# Altium project pqm_v2.PrjPCB (part 1 of 2)
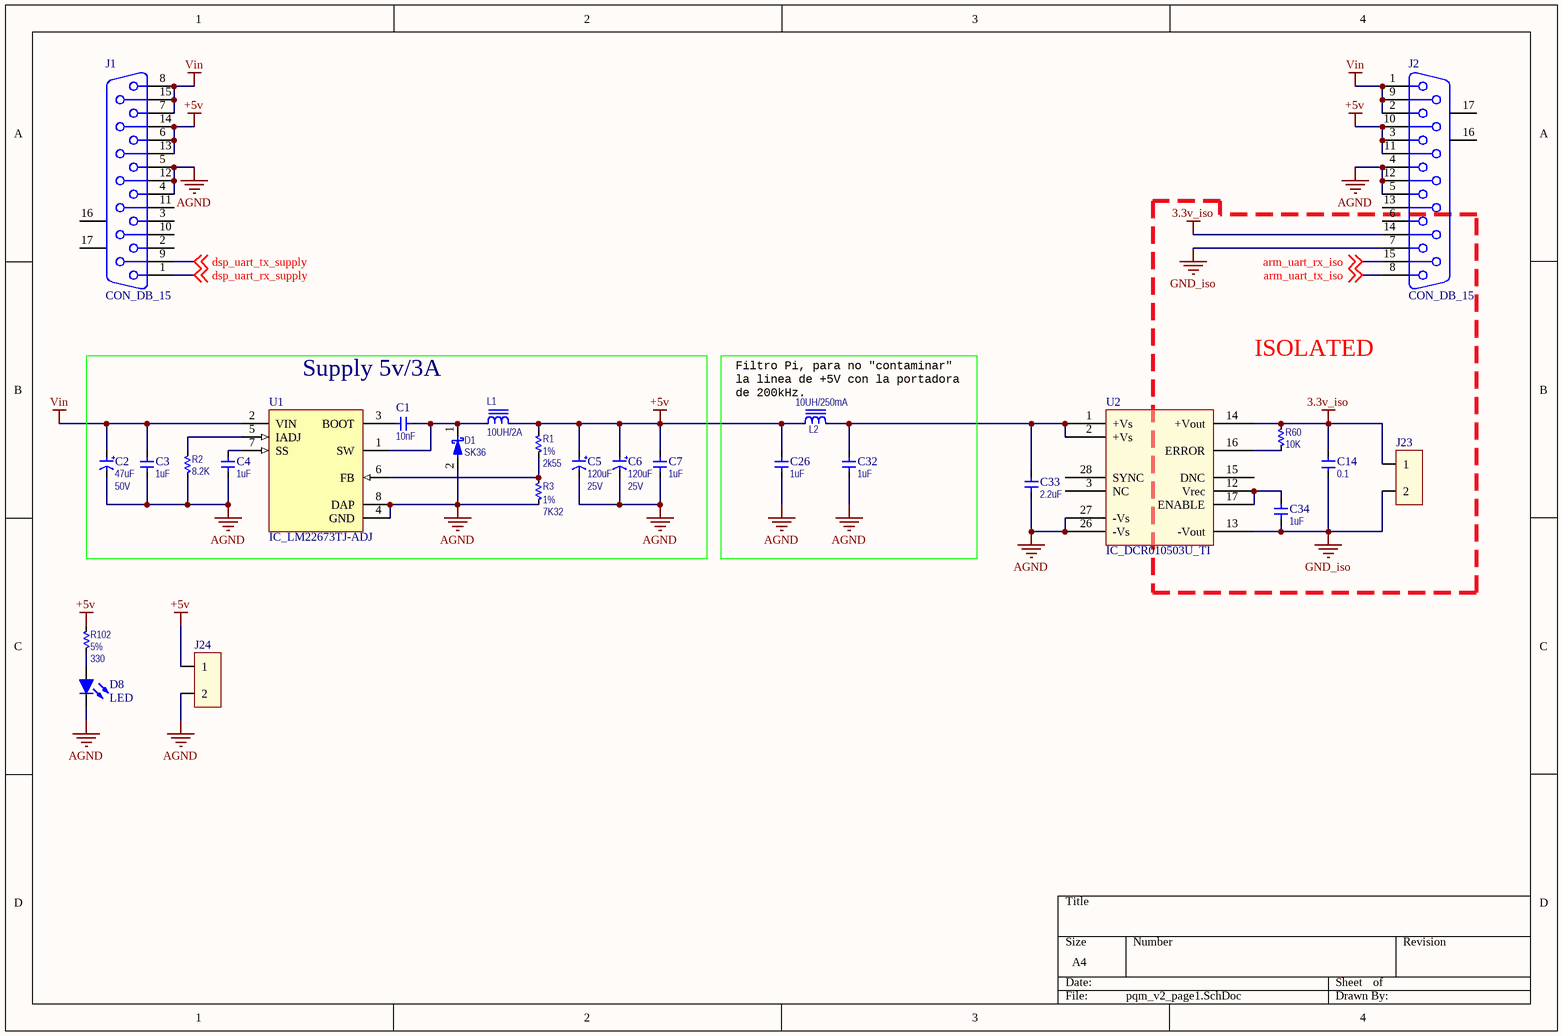
[diagram p0: pqm_v2_page1.SchDoc]
5 sheets, 276 parts. Net scope: global (net labels, ports and power ports of the same name join across sheets).
Board file: pqm_v2.PcbDoc
Sheets:
  pqm_v2_page1.SchDoc
  pqm_v2_page2.SchDoc
  pqm_v2_page3.SchDoc
  pqm_v2_page4.SchDoc
  pqm_v2_page5.SchDoc

## Sheet pqm_v2_page1.SchDoc: Power Quality Monitor
size A4

### Parts
C1  value 10nF  [CAPC3216X135N_B]  (hidden comment: CAP_C3216X7R2J103K115AA_TDK)
C2  value 47uF  Voltage Rating: 50V  [CAPAE630770X770N]  (hidden comment: CAP_EEE-1HA470XP_PANASONIC)
C3  value 1uF  [CAPC3216X135N_B]  (hidden comment: CAP_C3216X7R1E105M085AA_TDK)
C4  value 1uF  [CAPC3216X135N_B]  (hidden comment: CAP_C3216X7R1E105M085AA_TDK)
C5  value 120uF  Voltage Rating: 25V  [CAPPRD250W50D630H1250]  (hidden comment: CAP_ELXY250ELL121MF15D_UC)
C6  value 120uF  Voltage Rating: 25V  [CAPPRD250W50D630H1250]  (hidden comment: CAP_ELXY250ELL121MF15D_UC)
C7  value 1uF  [CAPC3216X135N_B]  (hidden comment: CAP_C3216X7R1E105M085AA_TDK)
C14  value 0.1  [CAPC2013X110N]  (hidden comment: CAP_CC0805KRX7R8BB104_YAGEO)
C26  value 1uF  [CAPC3216X135N_B]  (hidden comment: CAP_C3216X7R1E105M085AA_TDK)
C32  value 1uF  [CAPC3216X135N_B]  (hidden comment: CAP_C3216X7R1E105M085AA_TDK)
C33  value 2.2uF  [CAPC3216X135N_B]  (hidden comment: CAP_CC1206KKX7R7BB225_YAGEO)
C34  value 1uF  [CAPC2013X110N]  (hidden comment: CAP_CC0805KKX7R7BB105_YAGEO)
D1  value SK36  [DIOM7959X262N]  (hidden comment: DIO_SK36_MICROCOM)
D8  LED  [Led]
J1  CON_DB_15  [788757-1]
J2  CON_DB_15  [788757-1]
J23  CON_RADX2  [RAD2]  (value not drawn)
J24  CON_RADX2  [RAD2]  (value not drawn)
L1  value 10UH/2A  [MAG_INDUCTOR2A]  (hidden comment: MAG_SRR1005-100M_BOURNS)
L2  value 10UH/250mA  [INDC4532X170N]  (hidden comment: MAG_CM453232-100KLCT_BOURNS)
R1  value 2k55  Tolerance: 1%  [RESC3216N]  (hidden comment: RES_ERJ-8ENF2551V_Panasonic)
R2  value 8.2K  [RESC3216N]  (hidden comment: RES_ERJ-8GEYJ822V_Panasonic)
R3  value 7K32  Tolerance: 1%  [RESC3216N]  (hidden comment: RES_ERJ-8ENF7321V_Panasonic)
R60  value 10K  [RESC3216N]  (hidden comment: RES_RC1206FR-0710KL_Yageo)
R102  value 330  Tolerance: 5%  [RESC2013X065BN]  (hidden comment: RES_RC0805JR-07330RL_YAGEO)
U1  IC_LM22673TJ-ADJ  [TJ7A_N]
U2  IC_DCR010503U_TI  [SOP28]

### Blocks framed on the sheet
ISOLATED: C14 C34 J23 R60 U2
Supply 5v/3A: C1-C7 D1 L1 R1-R3 U1

### Nets
3.3v_iso: C14.1(T1) J2.14 J23.1 R60.2(T2) U2.14(+Vout)
+5v: C5.1 C6.1 C7.1(T1) C26.1(T1) J1.6 J1.13 J1.14 J2.3 J2.10 J2.11 J24.1 L1.2 L2.1 R1.1(T1) R102.2(T2)
AGND: C2.2 C3.2(T2) C4.2(T2) C5.2 C6.2 C7.2(T2) C26.2(T2) C32.2(T2) C33.2(T2) D1.2(A) D8.2(K) J1.4 J1.5 J1.12 J2.4 J2.5 J2.12 J24.2 R2.1(T1) R3.2(T2) U1.4(GND) U1.8(DAP) U2.26(-Vs) U2.27(-Vs)
GND_iso: C14.2(T2) C34.2(T2) J2.7 J23.2 U2.13(-Vout)
Vin: C2.1 C3.1(T1) J1.7 J1.8 J1.15 J2.1 J2.2 J2.9 U1.2(VIN)
arm_uart_rx_iso: J2.15 ; off-sheet arm_uart_rx_iso
arm_uart_tx_iso: J2.8 ; off-sheet arm_uart_tx_iso
dsp_uart_rx_supply: J1.1 ; off-sheet dsp_uart_rx_supply
dsp_uart_tx_supply: J1.9 ; off-sheet dsp_uart_tx_supply
NetC1_1: C1.1(T1) U1.3(BOOT)
NetC1_2: C1.2(T2) D1.1(K) L1.1 U1.1(SW)
NetC4_1: C4.1(T1) U1.7(SS)
NetC32_1: C32.1(T1) C33.1(T1) L2.2 U2.1(+Vs) U2.2(+Vs)
NetC34_1: C34.1(T1) U2.12(Vrec) U2.17(ENABLE)
NetD8_1: D8.1(A) R102.1(T1)
NetR1_2: R1.2(T2) R3.1(T1) U1.6(FB)
NetR2_2: R2.2(T2) U1.5(IADJ)
NetR60_1: R60.1(T1) U2.16(ERROR)

Not connected (* = marked no-connect by the designer): J1 2 3 10 11 16(MH1) 17(MH2); J2 6 13 16(MH1) 17(MH2); U2 3(NC) 15(DNC) 28(SYNC)

### Notes on the sheet
- (near L2) Filtro Pi, para no "contaminar" la linea de +5V con la portadora de 200kHz.

### Library data of the parts
C1 = CAP_C3216X7R2J103K115AA_TDK: 10000pF, 630 V, Capacitores cerámicos, X7R, 1206 (3216 métrico), 0.126" L x 0.063" A (3.20 mm x 1.60 mm); Manufacturer: TDK; Tolerance: 10%; Voltage Rating: 630 V; Supplier: *; Supplier Part No: *; Power Rating: *; BOM Populate: *; Digikey Part Number: 445-2291-1-ND; Mouser Part Number: 810-C3216X7R2J103K; Manufacturer Part Number: C3216X7R2J103K115AA
C2 = CAP_EEE-1HA470XP_PANASONIC: 47µF 50V Aluminum Capacitors Radial, Can - SMD 2000 Hrs @ 85°C; Tolerance: 20%; BOM Populate: *; Power Rating: *; Supplier Part No: *; Supplier: *; Manufacturer: Panasonic; Petra Part No: *; Digikey Part Number: PCE3929CT-ND; Mouser Part Number: 667-EEE-1HA470XP; Manufacturer Part Number: EEE-1HA470XP
C3 C4 C7 C26 C32 = CAP_C3216X7R1E105M085AA_TDK: 1 µF, 25 V, Capacitores cerámicos, X7R, 1206 (3216 métrico), 0.126" L x 0.063" A (3.20 mm x 1.60 mm); Manufacturer: TDK; Tolerance: 20%; Voltage Rating: 25V; Supplier: *; Supplier Part No: *; Power Rating: *; BOM Populate: *; Digikey Part Number: 445-4024-1-ND; Mouser Part Number: 810-C3216X7R1E105M-2; Manufacturer Part Number: C3216X7R1E105M085AA
C5 C6 = CAP_ELXY250ELL121MF15D_UC: CAP ALUM 120UF 20% 25V RADIAL; BOM Populate: *; Power Rating: *; Supplier Part No: *; Supplier: *; Digikey Part Number: 565-1791-ND; Tolerance: 20%; Petra Part No: *; Mouser Part Number: 661-ELXY250ELL121MF1; Manufacturer Part Number: ELXY250ELL121MF15D
C14 = CAP_CC0805KRX7R8BB104_YAGEO: CAP CER 0.1UF 25V 10% X7R 0805; Manufacturer: Yageo; Supplier: *; Tolerance: 10%; Power Rating: *; Voltage Rating: 25V; BOM Populate: *; Digikey Part Number: 311-1141-1-ND; Mouser Part Number: 603-CC805KRX7R8BB104; Manufacturer Part Number: CC0805KRX7R8BB104
C33 = CAP_CC1206KKX7R7BB225_YAGEO: CAP CER 2.2UF 16V X7R 1206; Manufacturer: YAGEO; Tolerance: 10%; Supplier: *; Supplier Part No: *; Power Rating: *; BOM Populate: *; Voltage Rating: 16V; Digikey Part Number: 311-1957-1-ND; Mouser Part Number: 603-CC126KKX7R7BB225; Manufacturer Part Number: CC1206KKX7R7BB225
C34 = CAP_CC0805KKX7R7BB105_YAGEO: CAP CER 1UF 16V X7R 0805; Manufacturer: YAGEO; Tolerance: 10%; Supplier: *; Supplier Part No: *; Power Rating: *; BOM Populate: *; Voltage Rating: 16V; Digikey Part Number: 311-1365-1-ND; Mouser Part Number: 603-CC805KKX7R7BB105; Manufacturer Part Number: CC0805KKX7R7BB105
D1 = DIO_SK36_MICROCOM: DIODE SCHOTTKY 60V 3A SMC; Manufacturer: Micro Commercial Co; Manufacturer Part Number: SK36-TP; BOM Populate: *; Voltage Rating: 60V; Supplier Part No: *; Supplier: *; Digikey Part Number: SK36-TPMSCT-ND; Tolerance: *; Power Rating: *; Mouser Part Number: 833-SK36-TP
D8 = LED0: Published: 8-Jun-2000; LatestRevisionDate: 08-Jul-2005; LatestRevisionNote: Mech Layer 1 removed.; PackageReference: LED-0; Publisher: Altium Limited
J1 J2 = 788781-1: Receptacle Assembly, 15 Position, Right Angle, 8.08mm Series, Amplimite, with Screwlocks; Positions: 15; MatingConnector: Female Screw Locks; PCB_Layout: Complies with manufacturer's recommendation.; DrillSize: Corresponds to nominal value.; Published: 15-Jun-2001; LatestRevisionDate: 17-Jul-2002; LatestRevisionNote: Re-released for DXP Platform.; DatasheetDocument: Sep-1999; PackageDocument: Sep-1999; PackageReference: 788781-1; Publisher: Altium Limited; Orientation: Right Angle; Gender: Receptacle; ShellSize: 2; ComponentLink1Description: Manufacturer Link; ComponentLink1URL: http://www.tycoelectronics.com/; ComponentLink2Description: Packaging Specification; ComponentLink2URL: http://ecommas.tycoelectronics.com/commerce/DocumentDelivery/DDEController?Action=showdoc&DocId=Customer+Drawing%7F788781%7FO%7Fpdf%7FEnglish%7FENG_CD_788781_O.pdf
L1 = MAG_SRR1005-100M_BOURNS: FIXED IND 10UH 2A 65 MOHM SMD; Manufacturer: Bourns Inc; BOM Populate: *; Current Rating: *; Supplier: *; Supplier Part No: *; Voltage Rating: *; Tolerance: *; Digikey Part Number: SRR1005-100MCT-ND; Manufacturer Part Number: SRR1005-100M; Mouser Part Number: 652-SRR1005-100M
L2 = MAG_CM453232-100KLCT_BOURNS: FIXED IND 10UH 2A 65 MOHM SMD; Manufacturer: Bourns Inc; BOM Populate: *; Current Rating: *; Supplier: *; Supplier Part No: *; Voltage Rating: *; Tolerance: *; Digikey Part Number: CM453232-100KLCT-ND; Manufacturer Part Number: CM453232-100KL; Mouser Part Number: 652-CM453232-100KL
R1 = RES_ERJ-8ENF2551V_Panasonic: RES SMD 2.55K OHM 1% 1/4W 1206; BOM Populate: *; Supplier Part No: *; Supplier: *; Manufacturer: Panasonic; Digikey Part Number: P2.55KFCT-ND; Power Rating: 1/4W; Manufacturer Part Number: ERJ-8ENF2551V; Mouser Part Number: 667-ERJ-8ENF2551V
R2 = RES_ERJ-8GEYJ822V_Panasonic: RES SMD 8.2K OHM 5% 1/4W 1206; BOM Populate: *; Supplier Part No: *; Supplier: *; Tolerance: 5%; Manufacturer: Panasonic; Digikey Part Number: P8.2KECT-ND; Power Rating: 1/4W; Manufacturer Part Number: ERJ-8GEYJ822V; Mouser Part Number: 667-ERJ-8GEYJ822V
R3 = RES_ERJ-8ENF7321V_Panasonic: RES SMD 7.32K OHM 1% 1/4W 1206; BOM Populate: *; Supplier Part No: *; Supplier: *; Manufacturer: Panasonic; Digikey Part Number: P7.32KFCT-ND; Power Rating: 1/4W; Manufacturer Part Number: ERJ-8ENF7321V; Mouser Part Number: 667-ERJ-8ENF7321V
R60 = RES_RC1206FR-0710KL_Yageo: RES SMD 10K OHM 1% 1/4W 1206; Manufacturer: Yageo; BOM Populate: *; Supplier Part No: *; Supplier: *; Tolerance: 1%; Digikey Part Number: 311-10.0KFRCT-ND; Power Rating: 1/4W; Manufacturer Part Number: RC1206FR-0710KL; Mouser Part Number: 603-RC1206FR-0710KL
R102 = RES_RC0805JR-07330RL_YAGEO: RES SMD 330 OHM 5% 1/8W 0805; Manufacturer: Yageo; BOM Populate: *; Supplier Part No: *; Supplier: *; Digikey Part Number: 311-330ARCT-ND; Power Rating: 1/8W; Manufacturer Part Number: RC0805JR-07330RL; Mouser Part Number: 603-RC0805JR-07330RL
U1 = IC_LM22673TJ-ADJ: 3A SIMPLE SWITCHER® Step-Down Voltage Regulator with Adjustable Soft-Start and Current Limit, 7-pin TO-263 Thin; Manufacturer Part Number: LM22673TJ-ADJ/NOPB; Digikey Part Number: LM22673TJ-ADJ/NOPBCT-ND; Mouser Part Number: 926-LM22673TJADJNOPB
U2 = IC_DCR010503U_TI: IC REG ISOLATED 3.3V 0.3A 12SOP; Digikey Part Number: 296-9450-5-ND; Mouser Part Number: 595-DCR010503U; Manufacturer Part Number: DCR010503U

## Sheet pqm_v2_page2.SchDoc
size A4
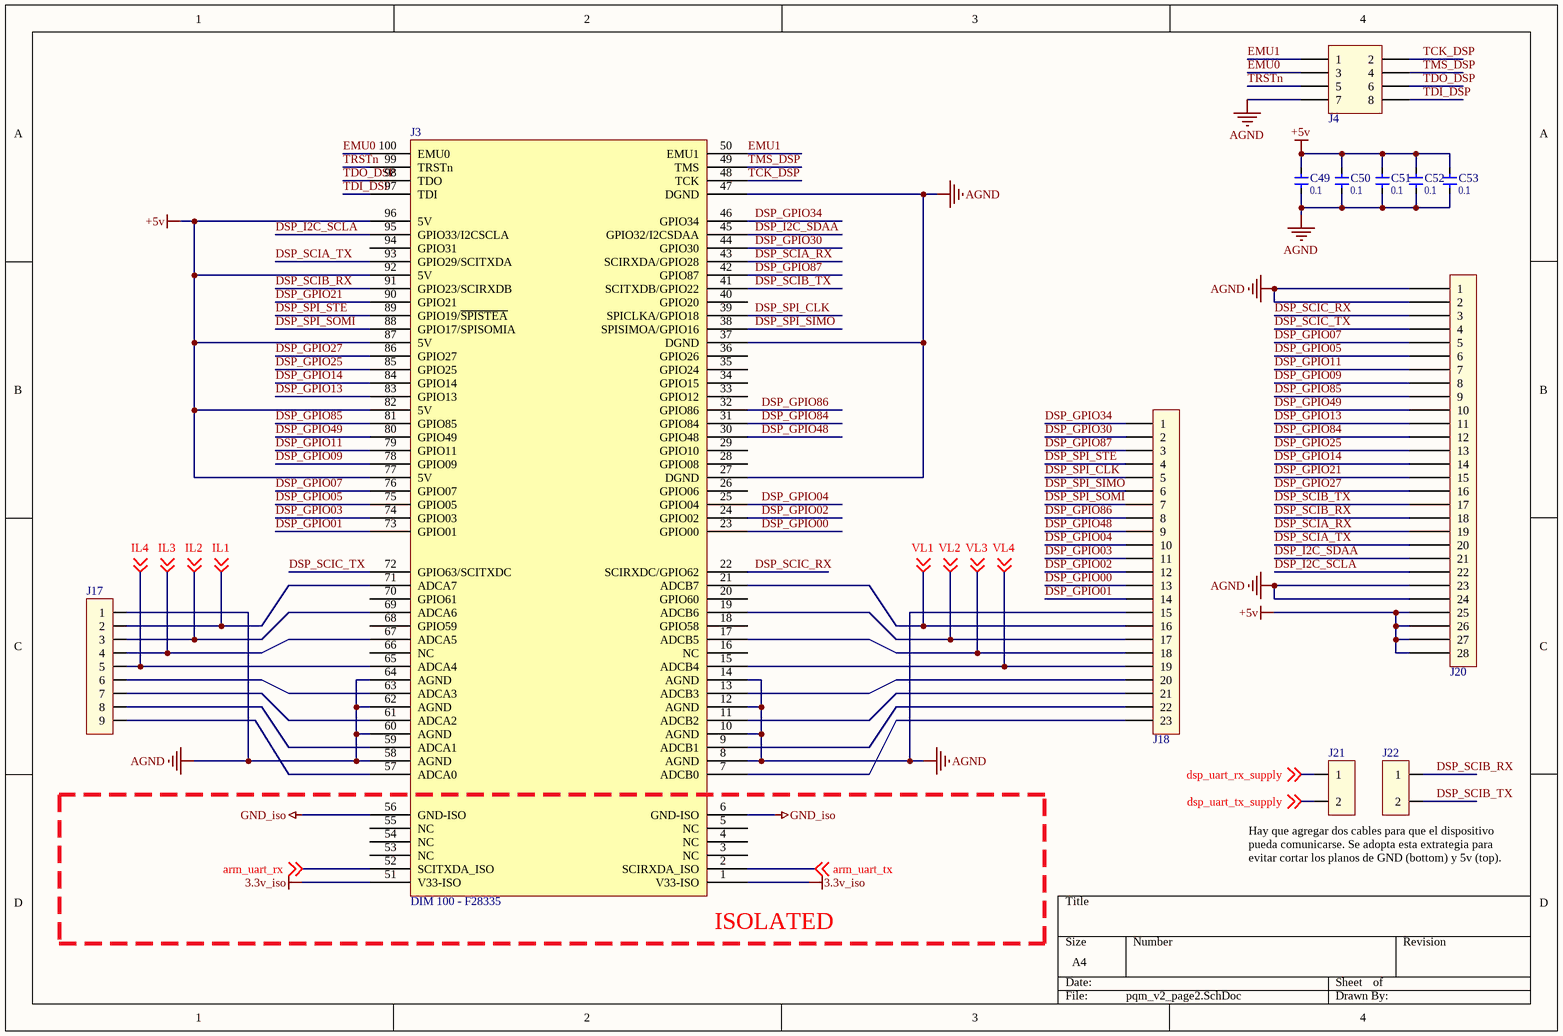
[diagram p1: pqm_v2_page2.SchDoc]

### Parts
C49  value 0.1  [CAPC2013X110N]  (hidden comment: CAP_CC0805KRX7R8BB104_YAGEO)
C50  value 0.1  [CAPC2013X110N]  (hidden comment: CAP_CC0805KRX7R8BB104_YAGEO)
C51  value 0.1  [CAPC2013X110N]  (hidden comment: CAP_CC0805KRX7R8BB104_YAGEO)
C52  value 0.1  [CAPC2013X110N]  (hidden comment: CAP_CC0805KRX7R8BB104_YAGEO)
C53  value 0.1  [CAPC2013X110N]  (hidden comment: CAP_CC0805KRX7R8BB104_YAGEO)
J3  DIM 100 - F28335  [DIMM1.27-2V100]
J4  CON_Header_2X4  [HDR2X4]  (value not drawn)
J17  COM_HeaderX9  [HDRX9]  (value not drawn)
J18  Header_DSP_1  [HEADER_DSP_1]  (value not drawn)
J20  CON_HeaderX30  [HeaderX30]  (value not drawn)
J21  CON_RADX2b  [RAD2b]  (value not drawn)
J22  CON_RADX2b  [RAD2b]  (value not drawn)

### Nets
3.3v_iso: J3.1(V33-ISO) J3.51(V33-ISO)
+5v: C49.1(T1) C50.1(T1) C51.1(T1) C52.1(T1) C53.1(T1) J3.77(5V) J3.82(5V) J3.87(5V) J3.92(5V) J3.96(5V) J20.25 J20.26 J20.27 J20.28
AGND: C49.2(T2) C50.2(T2) C51.2(T2) C52.2(T2) C53.2(T2) J3.8(AGND) J3.10(AGND) J3.12(AGND) J3.14(AGND) J3.27(DGND) J3.37(DGND) J3.47(DGND) J3.58(AGND) J3.60(AGND) J3.62(AGND) J3.64(AGND) J4.7 J17.1 J18.15 J20.1 J20.2 J20.23 J20.24
GND_iso: J3.6(GND-ISO) J3.56(GND-ISO)
arm_uart_rx: J3.52(SCITXDA_ISO) ; off-sheet arm_uart_rx
arm_uart_tx: J3.2(SCIRXDA_ISO) ; off-sheet arm_uart_tx
DSP_GPIO00: J3.23(GPIO00) J18.13
DSP_GPIO01: J3.73(GPIO01) J18.14
DSP_GPIO02: J3.24(GPIO02) J18.12
DSP_GPIO03: J3.74(GPIO03) J18.11
DSP_GPIO04: J3.25(GPIO04) J18.10
DSP_GPIO05: J3.75(GPIO05) J20.6
DSP_GPIO07: J3.76(GPIO07) J20.5
DSP_GPIO09: J3.78(GPIO09) J20.8
DSP_GPIO11: J3.79(GPIO11) J20.7
DSP_GPIO13: J3.83(GPIO13) J20.11
DSP_GPIO14: J3.84(GPIO14) J20.14
DSP_GPIO21: J3.90(GPIO21) J20.15
DSP_GPIO25: J3.85(GPIO25) J20.13
DSP_GPIO27: J3.86(GPIO27) J20.16
DSP_GPIO30: J3.44(GPIO30) J18.2
DSP_GPIO34: J3.46(GPIO34) J18.1
DSP_GPIO48: J3.30(GPIO48) J18.9
DSP_GPIO49: J3.80(GPIO49) J20.10
DSP_GPIO84: J3.31(GPIO84) J20.12
DSP_GPIO85: J3.81(GPIO85) J20.9
DSP_GPIO86: J3.32(GPIO86) J18.8
DSP_GPIO87: J3.42(GPIO87) J18.3
DSP_I2C_SCLA: J3.95(GPIO33/I2CSCLA) J20.22
DSP_I2C_SDAA: J3.45(GPIO32/I2CSDAA) J20.21
DSP_SCIA_RX: J3.43(SCIRXDA/GPIO28) J20.19
DSP_SCIA_TX: J3.93(GPIO29/SCITXDA) J20.20
DSP_SCIB_RX: J3.91(GPIO23/SCIRXDB) J20.18 J22.1
DSP_SCIB_TX: J3.41(SCITXDB/GPIO22) J20.17 J22.2
DSP_SCIC_RX: J3.22(SCIRXDC/GPIO62) J20.3
DSP_SCIC_TX: J3.72(GPIO63/SCITXDC) J20.4
DSP_SPI_CLK: J3.39(SPICLKA/GPIO18) J18.5
DSP_SPI_SIMO: J3.38(SPISIMOA/GPIO16) J18.6
DSP_SPI_SOMI: J3.88(GPIO17/SPISOMIA) J18.7
DSP_SPI_STE: J3.89(GPIO19/~{SPISTEA}) J18.4
dsp_uart_rx_supply: J21.1 ; off-sheet dsp_uart_rx_supply
dsp_uart_tx_supply: J21.2 ; off-sheet dsp_uart_tx_supply
EMU0: J3.100(EMU0) J4.3
EMU1: J3.50(EMU1) J4.1
IL1: J3.71(ADCA7) J17.2 ; off-sheet IL1
IL2: J3.69(ADCA6) J17.3 ; off-sheet IL2
IL3: J3.67(ADCA5) J17.4 ; off-sheet IL3
IL4: J3.65(ADCA4) J17.5 ; off-sheet IL4
TCK_DSP: J3.48(TCK) J4.2
TDI_DSP: J3.97(TDI) J4.8
TDO_DSP: J3.98(TDO) J4.6
TMS_DSP: J3.49(TMS) J4.4
TRSTn: J3.99(TRSTn) J4.5
VL1: J3.21(ADCB7) J18.16 ; off-sheet VL1
VL2: J3.19(ADCB6) J18.17 ; off-sheet VL2
VL3: J3.17(ADCB5) J18.18 ; off-sheet VL3
VL4: J3.15(ADCB4) J18.19 ; off-sheet VL4
NetJ3_7: J3.7(ADCB0) J18.23
NetJ3_9: J3.9(ADCB1) J18.22
NetJ3_11: J3.11(ADCB2) J18.21
NetJ3_13: J3.13(ADCB3) J18.20
NetJ3_57: J3.57(ADCA0) J17.9
NetJ3_59: J3.59(ADCA1) J17.8
NetJ3_61: J3.61(ADCA2) J17.7
NetJ3_63: J3.63(ADCA3) J17.6

Not connected (* = marked no-connect by the designer): J3 3(NC) 4(NC) 5(NC) 16(NC) 18(GPIO58) 20(GPIO60) 26(GPIO06) 28(GPIO08) 29(GPIO10) 33(GPIO12) 34(GPIO15) 35(GPIO24) 36(GPIO26) 40(GPIO20) 53(NC) 54(NC) 55(NC) 66(NC) 68(GPIO59) 70(GPIO61) 94(GPIO31)

### Notes on the sheet
- Hay que agregar dos cables para que el dispositivo pueda comunicarse. Se adopta esta extrategia para evitar cortar los planos de GND (bottom) y 5v (top).
- (near J3) ISOLATED

### Library data of the parts
C49-C53 = CAP_CC0805KRX7R8BB104_YAGEO: as C14 on sheet pqm_v2_page1; Supplier: *; Tolerance: 10%; Power Rating: *; Voltage Rating: 25V; BOM Populate: *; Digikey Part Number: 311-1141-1-ND; Mouser Part Number: 603-CC805KRX7R8BB104; Manufacturer Part Number: CC0805KRX7R8BB104
J3 = CON_DIM_100: Manufacturer Part Number: 5390213-1; Digikey Part Number: A121375-ND; Mouser Part Number: 571-5390213-1

## Sheet pqm_v2_page3.SchDoc
size A4
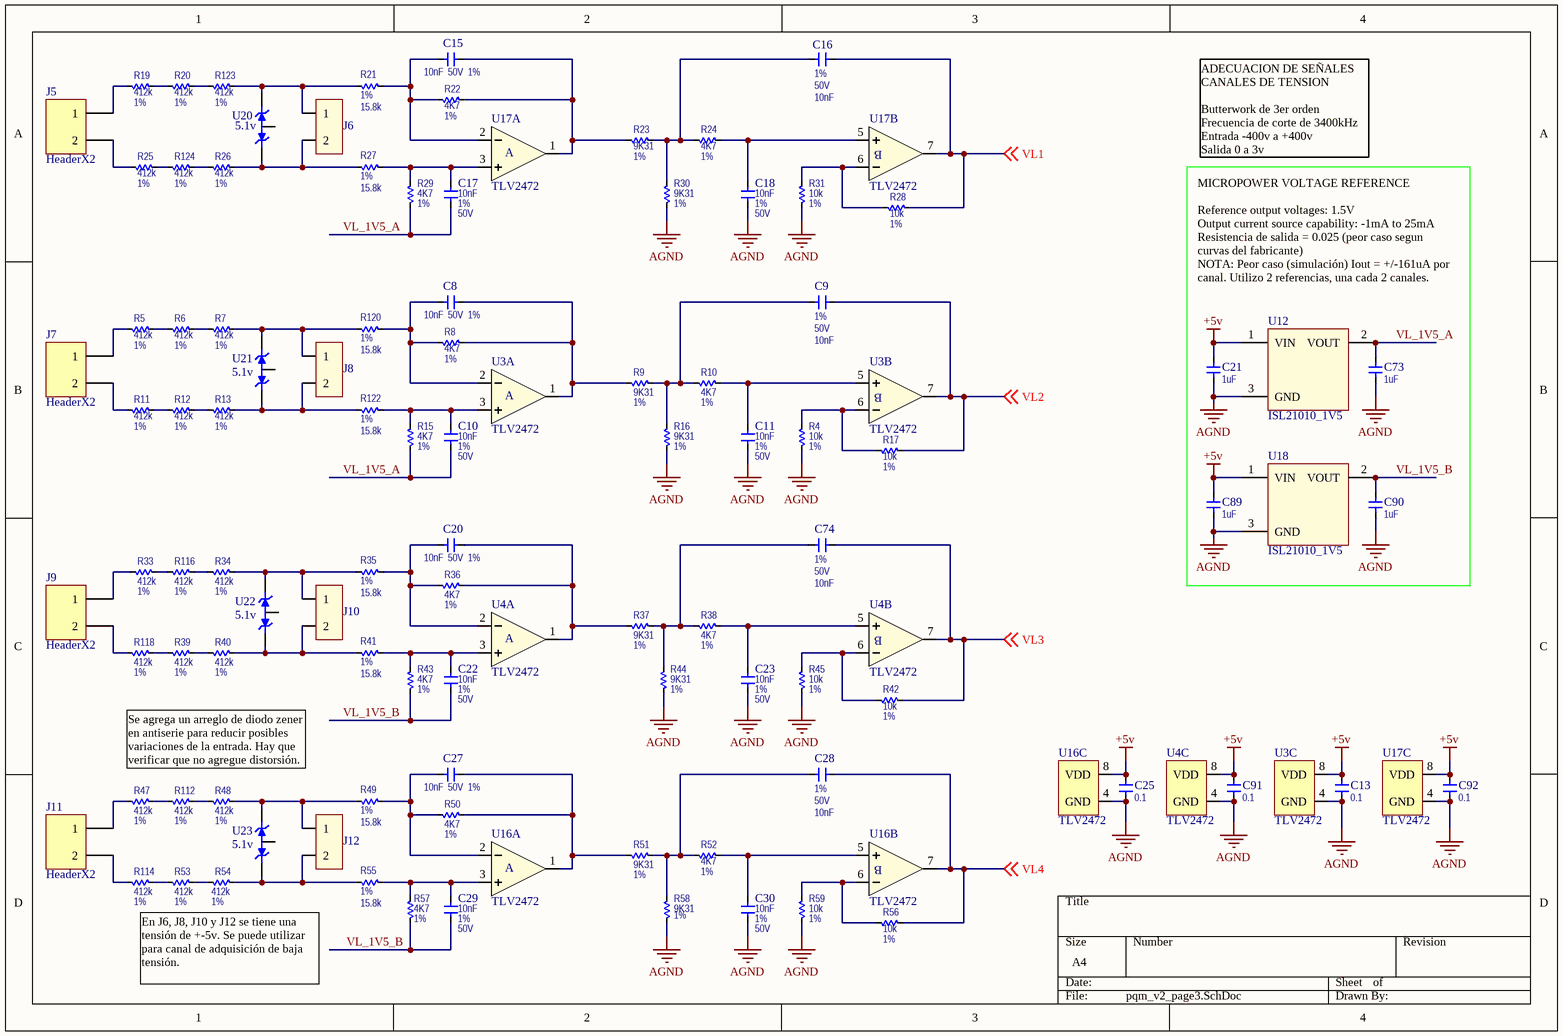
[diagram p2: pqm_v2_page3.SchDoc]

### Parts
C8  value 10nF  Tolerance: 1%  Voltage Rating: 50V  [CAPC2013X110N]  (hidden comment: CAP_GRM2195C1H103FA01D_MURATA)
C9  value 10nF  Tolerance: 1%  Voltage Rating: 50V  [CAPC2013X110N]  (hidden comment: CAP_GRM2195C1H103FA01D_MURATA)
C10  value 10nF  Tolerance: 1%  Voltage Rating: 50V  [CAPC2013X110N]  (hidden comment: CAP_GRM2195C1H103FA01D_MURATA)
C11  value 10nF  Tolerance: 1%  Voltage Rating: 50V  [CAPC2013X110N]  (hidden comment: CAP_GRM2195C1H103FA01D_MURATA)
C13  value 0.1  [CAPC2013X110N]  (hidden comment: CAP_CC0805KRX7R8BB104_YAGEO)
C15  value 10nF  Tolerance: 1%  Voltage Rating: 50V  [CAPC2013X110N]  (hidden comment: CAP_GRM2195C1H103FA01D_MURATA)
C16  value 10nF  Tolerance: 1%  Voltage Rating: 50V  [CAPC2013X110N]  (hidden comment: CAP_GRM2195C1H103FA01D_MURATA)
C17  value 10nF  Tolerance: 1%  Voltage Rating: 50V  [CAPC2013X110N]  (hidden comment: CAP_GRM2195C1H103FA01D_MURATA)
C18  value 10nF  Tolerance: 1%  Voltage Rating: 50V  [CAPC2013X110N]  (hidden comment: CAP_GRM2195C1H103FA01D_MURATA)
C20  value 10nF  Tolerance: 1%  Voltage Rating: 50V  [CAPC2013X110N]  (hidden comment: CAP_GRM2195C1H103FA01D_MURATA)
C21  value 1uF  [CAPC2013X110N]  (hidden comment: CAP_CC0805KKX7R7BB105_YAGEO)
C22  value 10nF  Tolerance: 1%  Voltage Rating: 50V  [CAPC2013X110N]  (hidden comment: CAP_GRM2195C1H103FA01D_MURATA)
C23  value 10nF  Tolerance: 1%  Voltage Rating: 50V  [CAPC2013X110N]  (hidden comment: CAP_GRM2195C1H103FA01D_MURATA)
C25  value 0.1  [CAPC2013X110N]  (hidden comment: CAP_CC0805KRX7R8BB104_YAGEO)
C27  value 10nF  Tolerance: 1%  Voltage Rating: 50V  [CAPC2013X110N]  (hidden comment: CAP_GRM2195C1H103FA01D_MURATA)
C28  value 10nF  Tolerance: 1%  Voltage Rating: 50V  [CAPC2013X110N]  (hidden comment: CAP_GRM2195C1H103FA01D_MURATA)
C29  value 10nF  Tolerance: 1%  Voltage Rating: 50V  [CAPC2013X110N]  (hidden comment: CAP_GRM2195C1H103FA01D_MURATA)
C30  value 10nF  Tolerance: 1%  Voltage Rating: 50V  [CAPC2013X110N]  (hidden comment: CAP_GRM2195C1H103FA01D_MURATA)
C73  value 1uF  [CAPC2013X110N]  (hidden comment: CAP_CC0805KKX7R7BB105_YAGEO)
C74  value 10nF  Tolerance: 1%  Voltage Rating: 50V  [CAPC2013X110N]  (hidden comment: CAP_GRM2195C1H103FA01D_MURATA)
C89  value 1uF  [CAPC2013X110N]  (hidden comment: CAP_CC0805KKX7R7BB105_YAGEO)
C90  value 1uF  [CAPC2013X110N]  (hidden comment: CAP_CC0805KKX7R7BB105_YAGEO)
C91  value 0.1  [CAPC2013X110N]  (hidden comment: CAP_CC0805KRX7R8BB104_YAGEO)
C92  value 0.1  [CAPC2013X110N]  (hidden comment: CAP_CC0805KRX7R8BB104_YAGEO)
J5  HeaderX2  [PHOENIX_1729128]
J6  CON_RADX2  [RAD2]  (value not drawn)
J7  HeaderX2  [PHOENIX_1729128]
J8  CON_RADX2  [RAD2]  (value not drawn)
J9  HeaderX2  [PHOENIX_1729128]
J10  CON_RADX2  [RAD2]  (value not drawn)
J11  HeaderX2  [PHOENIX_1729128]
J12  CON_RADX2  [RAD2]  (value not drawn)
R4  value 10k  Tolerance: 1%  [RESC2013X065BN]  (hidden comment: RES_RC0805FR-0710KL_YAGEO)
R5  value 412k  Tolerance: 1%  [RESC2013X065BN]  (hidden comment: RES_RC0805FR-07412KL_YAGEO)
R6  value 412k  Tolerance: 1%  [RESC2013X065BN]  (hidden comment: RES_RC0805FR-07412KL_YAGEO)
R7  value 412k  Tolerance: 1%  [RESC2013X065BN]  (hidden comment: RES_RC0805FR-07412KL_YAGEO)
R8  value 4K7  Tolerance: 1%  [RESC2013X065BN]  (hidden comment: RES_RC0805FR-074K7L_YAGEO)
R9  value 9K31  Tolerance: 1%  [RESC2013X065BN]  (hidden comment: RES_RC0805FR-079K31L_YAGEO)
R10  value 4K7  Tolerance: 1%  [RESC2013X065BN]  (hidden comment: RES_RC0805FR-074K7L_YAGEO)
R11  value 412k  Tolerance: 1%  [RESC2013X065BN]  (hidden comment: RES_RC0805FR-07412KL_YAGEO)
R12  value 412k  Tolerance: 1%  [RESC2013X065BN]  (hidden comment: RES_RC0805FR-07412KL_YAGEO)
R13  value 412k  Tolerance: 1%  [RESC2013X065BN]  (hidden comment: RES_RC0805FR-07412KL_YAGEO)
R15  value 4K7  Tolerance: 1%  [RESC2013X065BN]  (hidden comment: RES_RC0805FR-074K7L_YAGEO)
R16  value 9K31  Tolerance: 1%  [RESC2013X065BN]  (hidden comment: RES_RC0805FR-079K31L_YAGEO)
R17  value 10k  Tolerance: 1%  [RESC2013X065BN]  (hidden comment: RES_RC0805FR-0710KL_YAGEO)
R19  value 412k  Tolerance: 1%  [RESC2013X065BN]  (hidden comment: RES_RC0805FR-07412KL_YAGEO)
R20  value 412k  Tolerance: 1%  [RESC2013X065BN]  (hidden comment: RES_RC0805FR-07412KL_YAGEO)
R21  value 15.8k  Tolerance: 1%  [RESC2013X065BN]  (hidden comment: RES_RC0805FR-0715K8L_YAGEO)
R22  value 4K7  Tolerance: 1%  [RESC2013X065BN]  (hidden comment: RES_RC0805FR-074K7L_YAGEO)
R23  value 9K31  Tolerance: 1%  [RESC2013X065BN]  (hidden comment: RES_RC0805FR-079K31L_YAGEO)
R24  value 4K7  Tolerance: 1%  [RESC2013X065BN]  (hidden comment: RES_RC0805FR-074K7L_YAGEO)
R25  value 412k  Tolerance: 1%  [RESC2013X065BN]  (hidden comment: RES_RC0805FR-07412KL_YAGEO)
R26  value 412k  Tolerance: 1%  [RESC2013X065BN]  (hidden comment: RES_RC0805FR-07412KL_YAGEO)
R27  value 15.8k  Tolerance: 1%  [RESC2013X065BN]  (hidden comment: RES_RC0805FR-0715K8L_YAGEO)
R28  value 10k  Tolerance: 1%  [RESC2013X065BN]  (hidden comment: RES_RC0805FR-0710KL_YAGEO)
R29  value 4K7  Tolerance: 1%  [RESC2013X065BN]  (hidden comment: RES_RC0805FR-074K7L_YAGEO)
R30  value 9K31  Tolerance: 1%  [RESC2013X065BN]  (hidden comment: RES_RC0805FR-079K31L_YAGEO)
R31  value 10k  Tolerance: 1%  [RESC2013X065BN]  (hidden comment: RES_RC0805FR-0710KL_YAGEO)
R33  value 412k  Tolerance: 1%  [RESC2013X065BN]  (hidden comment: RES_RC0805FR-07412KL_YAGEO)
R34  value 412k  Tolerance: 1%  [RESC2013X065BN]  (hidden comment: RES_RC0805FR-07412KL_YAGEO)
R35  value 15.8k  Tolerance: 1%  [RESC2013X065BN]  (hidden comment: RES_RC0805FR-0715K8L_YAGEO)
R36  value 4K7  Tolerance: 1%  [RESC2013X065BN]  (hidden comment: RES_RC0805FR-074K7L_YAGEO)
R37  value 9K31  Tolerance: 1%  [RESC2013X065BN]  (hidden comment: RES_RC0805FR-079K31L_YAGEO)
R38  value 4K7  Tolerance: 1%  [RESC2013X065BN]  (hidden comment: RES_RC0805FR-074K7L_YAGEO)
R39  value 412k  Tolerance: 1%  [RESC2013X065BN]  (hidden comment: RES_RC0805FR-07412KL_YAGEO)
R40  value 412k  Tolerance: 1%  [RESC2013X065BN]  (hidden comment: RES_RC0805FR-07412KL_YAGEO)
R41  value 15.8k  Tolerance: 1%  [RESC2013X065BN]  (hidden comment: RES_RC0805FR-0715K8L_YAGEO)
R42  value 10k  Tolerance: 1%  [RESC2013X065BN]  (hidden comment: RES_RC0805FR-0710KL_YAGEO)
R43  value 4K7  Tolerance: 1%  [RESC2013X065BN]  (hidden comment: RES_RC0805FR-074K7L_YAGEO)
R44  value 9K31  Tolerance: 1%  [RESC2013X065BN]  (hidden comment: RES_RC0805FR-079K31L_YAGEO)
R45  value 10k  Tolerance: 1%  [RESC2013X065BN]  (hidden comment: RES_RC0805FR-0710KL_YAGEO)
R47  value 412k  Tolerance: 1%  [RESC2013X065BN]  (hidden comment: RES_RC0805FR-07412KL_YAGEO)
R48  value 412k  Tolerance: 1%  [RESC2013X065BN]  (hidden comment: RES_RC0805FR-07412KL_YAGEO)
R49  value 15.8k  Tolerance: 1%  [RESC2013X065BN]  (hidden comment: RES_RC0805FR-0715K8L_YAGEO)
R50  value 4K7  Tolerance: 1%  [RESC2013X065BN]  (hidden comment: RES_RC0805FR-074K7L_YAGEO)
R51  value 9K31  Tolerance: 1%  [RESC2013X065BN]  (hidden comment: RES_RC0805FR-079K31L_YAGEO)
R52  value 4K7  Tolerance: 1%  [RESC2013X065BN]  (hidden comment: RES_RC0805FR-074K7L_YAGEO)
R53  value 412k  Tolerance: 1%  [RESC2013X065BN]  (hidden comment: RES_RC0805FR-07412KL_YAGEO)
R54  value 412k  Tolerance: 1%  [RESC2013X065BN]  (hidden comment: RES_RC0805FR-07412KL_YAGEO)
R55  value 15.8k  Tolerance: 1%  [RESC2013X065BN]  (hidden comment: RES_RC0805FR-0715K8L_YAGEO)
R56  value 10k  Tolerance: 1%  [RESC2013X065BN]  (hidden comment: RES_RC0805FR-0710KL_YAGEO)
R57  value 4K7  Tolerance: 1%  [RESC2013X065BN]  (hidden comment: RES_RC0805FR-074K7L_YAGEO)
R58  value 9K31  Tolerance: 1%  [RESC2013X065BN]  (hidden comment: RES_RC0805FR-079K31L_YAGEO)
R59  value 10k  Tolerance: 1%  [RESC2013X065BN]  (hidden comment: RES_RC0805FR-0710KL_YAGEO)
R112  value 412k  Tolerance: 1%  [RESC2013X065BN]  (hidden comment: RES_RC0805FR-07412KL_YAGEO)
R114  value 412k  Tolerance: 1%  [RESC2013X065BN]  (hidden comment: RES_RC0805FR-07412KL_YAGEO)
R116  value 412k  Tolerance: 1%  [RESC2013X065BN]  (hidden comment: RES_RC0805FR-07412KL_YAGEO)
R118  value 412k  Tolerance: 1%  [RESC2013X065BN]  (hidden comment: RES_RC0805FR-07412KL_YAGEO)
R120  value 15.8k  Tolerance: 1%  [RESC2013X065BN]  (hidden comment: RES_RC0805FR-0715K8L_YAGEO)
R122  value 15.8k  Tolerance: 1%  [RESC2013X065BN]  (hidden comment: RES_RC0805FR-0715K8L_YAGEO)
R123  value 412k  Tolerance: 1%  [RESC2013X065BN]  (hidden comment: RES_RC0805FR-07412KL_YAGEO)
R124  value 412k  Tolerance: 1%  [RESC2013X065BN]  (hidden comment: RES_RC0805FR-07412KL_YAGEO)
U3  value TLV2472  [SOIC127P600-8BN]  (hidden comment: IC_TLV2472_ANALOG)  (parts A,B,C of 3)
U4  value TLV2472  [SOIC127P600-8BN]  (hidden comment: IC_TLV2472_ANALOG)  (parts A,B,C of 3)
U12  ISL21010_1V5  [SOT23-3M]
U16  value TLV2472  [SOIC127P600-8BN]  (hidden comment: IC_TLV2472_ANALOG)  (parts A,B,C of 3)
U17  value TLV2472  [SOIC127P600-8BN]  (hidden comment: IC_TLV2472_ANALOG)  (parts A,B,C of 3)
U18  ISL21010_1V5  [SOT23-3M]
U20  Voltage: 5.1v  [SOT23-3M]  (hidden comment: IC_IAZ23C5V6-E3-18_VISHAY)
U21  Voltage: 5.1v  [SOT23-3M]  (hidden comment: IC_IAZ23C5V6-E3-18_VISHAY)
U22  Voltage: 5.1v  [SOT23-3M]  (hidden comment: IC_IAZ23C5V6-E3-18_VISHAY)
U23  Voltage: 5.1v  [SOT23-3M]  (hidden comment: IC_IAZ23C5V6-E3-18_VISHAY)

### Nets
+5v: C13.1(T1) C21.1(T1) C25.1(T1) C89.1(T1) C91.1(T1) C92.1(T1) U3.8(VDD) U4.8(VDD) U12.1(VIN) U16.8(VDD) U17.8(VDD) U18.1(VIN)
AGND: C11.1(T1) C13.2(T2) C18.1(T1) C21.2(T2) C23.1(T1) C25.2(T2) C30.1(T1) C73.2(T2) C89.2(T2) C90.2(T2) C91.2(T2) C92.2(T2) R4.2(T2) R16.1(T1) R30.2(T2) R31.2(T2) R44.2(T2) R45.2(T2) R58.1(T1) R59.2(T2) U3.4(GND) U4.4(GND) U12.3(GND) U16.4(GND) U17.4(GND) U18.3(GND)
VL1: C16.2(T2) R28.1(T1) U17.7(OUTB) ; off-sheet VL1
VL2: C9.2(T2) R17.1(T1) U3.7(OUTB) ; off-sheet VL2
VL3: C74.2(T2) R42.1(T1) U4.7(OUTB) ; off-sheet VL3
VL4: C28.2(T2) R56.1(T1) U16.7(OUTB) ; off-sheet VL4
VL_1V5_A: C10.1(T1) C17.1(T1) C73.1(T1) R15.2(T2) R29.2(T2) U12.2(VOUT)
VL_1V5_B: C22.1(T1) C29.1(T1) C90.1(T1) R43.2(T2) R57.2(T2) U18.2(VOUT)
NetC8_1: C8.1(T1) R8.2(T2) R120.1(T1) U3.2(INA-)
NetC8_2: C8.2(T2) R8.1(T1) R9.2(T2) U3.1(OUTA)
NetC9_1: C9.1(T1) R9.1(T1) R10.2(T2) R16.2(T2)
NetC10_2: C10.2(T2) R15.1(T1) R122.1(T1) U3.3(INA+)
NetC11_2: C11.2(T2) R10.1(T1) U3.5(INB+)
NetC15_1: C15.1(T1) R21.1(T1) R22.2(T2) U17.2(INA-)
NetC15_2: C15.2(T2) R22.1(T1) R23.2(T2) U17.1(OUTA)
NetC16_1: C16.1(T1) R23.1(T1) R24.2(T2) R30.1(T1)
NetC17_2: C17.2(T2) R27.1(T1) R29.1(T1) U17.3(INA+)
NetC18_2: C18.2(T2) R24.1(T1) U17.5(INB+)
NetC20_1: C20.1(T1) R35.1(T1) R36.2(T2) U4.2(INA-)
NetC20_2: C20.2(T2) R36.1(T1) R37.2(T2) U4.1(OUTA)
NetC22_2: C22.2(T2) R41.1(T1) R43.1(T1) U4.3(INA+)
NetC23_2: C23.2(T2) R38.1(T1) U4.5(INB+)
NetC27_1: C27.1(T1) R49.1(T1) R50.2(T2) U16.2(INA-)
NetC27_2: C27.2(T2) R50.1(T1) R51.1(T1) U16.1(OUTA)
NetC28_1: C28.1(T1) R51.2(T2) R52.2(T2) R58.2(T2)
NetC29_2: C29.2(T2) R55.1(T1) R57.1(T1) U16.3(INA+)
NetC30_2: C30.2(T2) R52.1(T1) U16.5(INB+)
NetC74_1: C74.1(T1) R37.1(T1) R38.2(T2) R44.1(T1)
NetJ5_1: J5.1 R19.2(T2)
NetJ5_2: J5.2 R25.2(T2)
NetJ6_1: J6.1 R21.2(T2) R123.1(T1) U20.1
NetJ6_2: J6.2 R26.1(T1) R27.2(T2) U20.2
NetJ7_1: J7.1 R5.2(T2)
NetJ7_2: J7.2 R11.2(T2)
NetJ8_1: J8.1 R7.1(T1) R120.2(T2) U21.1
NetJ8_2: J8.2 R13.1(T1) R122.2(T2) U21.2
NetJ9_1: J9.1 R33.2(T2)
NetJ9_2: J9.2 R118.2(T2)
NetJ10_1: J10.1 R34.1(T1) R35.2(T2) U22.1
NetJ10_2: J10.2 R40.1(T1) R41.2(T2) U22.2
NetJ11_1: J11.1 R47.2(T2)
NetJ11_2: J11.2 R114.2(T2)
NetJ12_1: J12.1 R48.1(T1) R49.2(T2) U23.1
NetJ12_2: J12.2 R54.1(T1) R55.2(T2) U23.2
NetR4_1: R4.1(T1) R17.2(T2) U3.6(INB-)
NetR5_1: R5.1(T1) R6.2(T2)
NetR6_1: R6.1(T1) R7.2(T2)
NetR11_1: R11.1(T1) R12.2(T2)
NetR12_1: R12.1(T1) R13.2(T2)
NetR19_1: R19.1(T1) R20.2(T2)
NetR20_1: R20.1(T1) R123.2(T2)
NetR25_1: R25.1(T1) R124.2(T2)
NetR26_2: R26.2(T2) R124.1(T1)
NetR28_2: R28.2(T2) R31.1(T1) U17.6(INB-)
NetR33_1: R33.1(T1) R116.2(T2)
NetR34_2: R34.2(T2) R116.1(T1)
NetR39_1: R39.1(T1) R40.2(T2)
NetR39_2: R39.2(T2) R118.1(T1)
NetR42_2: R42.2(T2) R45.1(T1) U4.6(INB-)
NetR47_1: R47.1(T1) R112.2(T2)
NetR48_2: R48.2(T2) R112.1(T1)
NetR53_1: R53.1(T1) R54.2(T2)
NetR53_2: R53.2(T2) R114.1(T1)
NetR56_2: R56.2(T2) R59.1(T1) U16.6(INB-)

Not connected (* = marked no-connect by the designer): U20 3; U21 3; U22 3; U23 3

### Notes on the sheet
- ADECUACION DE SEÑALES
  CANALES DE TENSION
  Butterwork de 3er orden
  Frecuencia de corte de 3400kHz
  Entrada -400v a +400v
  Salida 0 a 3v
- MICROPOWER VOLTAGE REFERENCE
  Reference output voltages: 1.5V
  Output current source capability: -1mA to 25mA
  Resistencia de salida = 0.025 (peor caso segun curvas del fabricante)
  NOTA: Peor caso (simulación) Iout = +/-161uA por canal. Utilizo 2 referencias, una cada 2 canales.
- Se agrega un arreglo de diodo zener en antiserie para reducir posibles variaciones de la entrada. Hay que verificar que no agregue distorsión.
- En J6, J8, J10 y J12 se tiene una tensión de +-5v. Se puede utilizar para canal de adquisición de baja tensión.
- (in symbol IC_TLV2472_ANALOG, part A) A
- (in symbol IC_TLV2472_ANALOG, part B) B

### Library data of the parts
C8-C11 C15-C18 C20 C22 C23 C27-C30 C74 = CAP_GRM2195C1H103FA01D_MURATA: CAP CER 10000PF 50V NP0 0805; Manufacturer: Murata Electronics North America; Supplier: *; Power Rating: *; BOM Populate: *; Digikey Part Number: 490-8295-1-ND; Mouser Part Number: 81-GRM2195C1H103FA1D; Manufacturer Part Number: GRM2195C1H103FA01D
C13 C25 C91 C92 = CAP_CC0805KRX7R8BB104_YAGEO: as C14 on sheet pqm_v2_page1; Supplier: *; Tolerance: 10%; Power Rating: *; Voltage Rating: 25V; BOM Populate: *; Digikey Part Number: 311-1141-1-ND; Mouser Part Number: 603-CC805KRX7R8BB104; Manufacturer Part Number: CC0805KRX7R8BB104
C21 C73 C89 C90 = CAP_CC0805KKX7R7BB105_YAGEO: as C34 on sheet pqm_v2_page1; Supplier: *; Supplier Part No: *; Power Rating: *; BOM Populate: *; Voltage Rating: 16V; Digikey Part Number: 311-1365-1-ND; Mouser Part Number: 603-CC805KKX7R7BB105; Manufacturer Part Number: CC0805KKX7R7BB105
J5 J7 J9 J11 = CON_HeaderX2
R4 R17 R28 R31 R42 R45 R56 R59 = RES_RC0805FR-0710KL_YAGEO: RES SMD 10K OHM 1% 1/8W 0805; Manufacturer: Yageo; BOM Populate: *; Supplier Part No: *; Supplier: *; Digikey Part Number: 311-10.0KCRCT-ND; Power Rating: 1/8W; Manufacturer Part Number: RC0805FR-0710KL; Mouser Part Number: 603-RC0805FR-0710KL
R5-R7 R11-R13 R19 R20 R25 R26 R33 R34 R39 R40 R47 R48 R53 R54 R112 R114 R116 R118 R123 R124 = RES_RC0805FR-07412KL_YAGEO: RES SMD 412K OHM 1% 1/8W 0805; Manufacturer: Yageo; BOM Populate: *; Supplier Part No: *; Supplier: *; Digikey Part Number: 311-412KCRCT-ND; Power Rating: 1/8W; Manufacturer Part Number: RC0805FR-07412KL; Mouser Part Number: 603-RC0805FR-07412KL
R8 R10 R15 R22 R24 R29 R36 R38 R43 R50 R52 R57 = RES_RC0805FR-074K7L_YAGEO: RES SMD 4.7K OHM 1% 1/8W 0805; Manufacturer: Yageo; BOM Populate: *; Supplier Part No: *; Supplier: *; Digikey Part Number: 311-4.70KCRCT-ND; Power Rating: 1/8W; Manufacturer Part Number: RC0805FR-074K7L; Mouser Part Number: 603-RC0805FR-074K7L
R9 R16 R23 R30 R37 R44 R51 R58 = RES_RC0805FR-079K31L_YAGEO: RES SMD 9.31K OHM 1% 1/8W 0805; Manufacturer: Yageo; BOM Populate: *; Supplier Part No: *; Supplier: *; Digikey Part Number: 311-9.31KCRCT-ND; Power Rating: 1/8W; Manufacturer Part Number: RC0805FR-079K31L; Mouser Part Number: 603-RC0805FR-079K31L
R21 R27 R35 R41 R49 R55 R120 R122 = RES_RC0805FR-0715K8L_YAGEO: RES SMD 15.8K OHM 1% 1/8W 0805; Manufacturer: Yageo; BOM Populate: *; Supplier Part No: *; Supplier: *; Digikey Part Number: 311-15.8KCRCT-ND; Power Rating: 1/8W; Manufacturer Part Number: RC0805FR-0715K8L; Mouser Part Number: 603-RC0805FR-0715K8L
U3 U4 U16 U17 = IC_TLV2472_ANALOG: IC OPAMP GP 2.8MHZ RRO 8SOIC; Manufacturer: Texas Instrument; Manufacturer Part Number: TLV2472CDR; Digikey Part Number: 296-2440-1-ND; Mouser Part Number: 595-TLV2472CDR
U12 U18 = IC_ISL21010_1V5_INTERSIL: IC VREF SERIES 1.5V SOT23-3; Manufacturer Part Number: ISL21010CFH315Z-TK; Digikey Part Number: ISL21010CFH315Z-TKCT-ND; Mouser Part Number: 968-ISL21010CFH315ZT
U20-U23 = IC_IAZ23C5V6-E3-18_VISHAY: DIODE ZENER ARRAY 5.6V SOT23; Digikey Part Number: AZ23C5V6-E3-18CT-ND; Manufacturer Part Number: AZ23C5V6-E3-18; Mouser Part Number: 78-AZ23C5V6-E3-18

## Sheet pqm_v2_page4.SchDoc
size A4
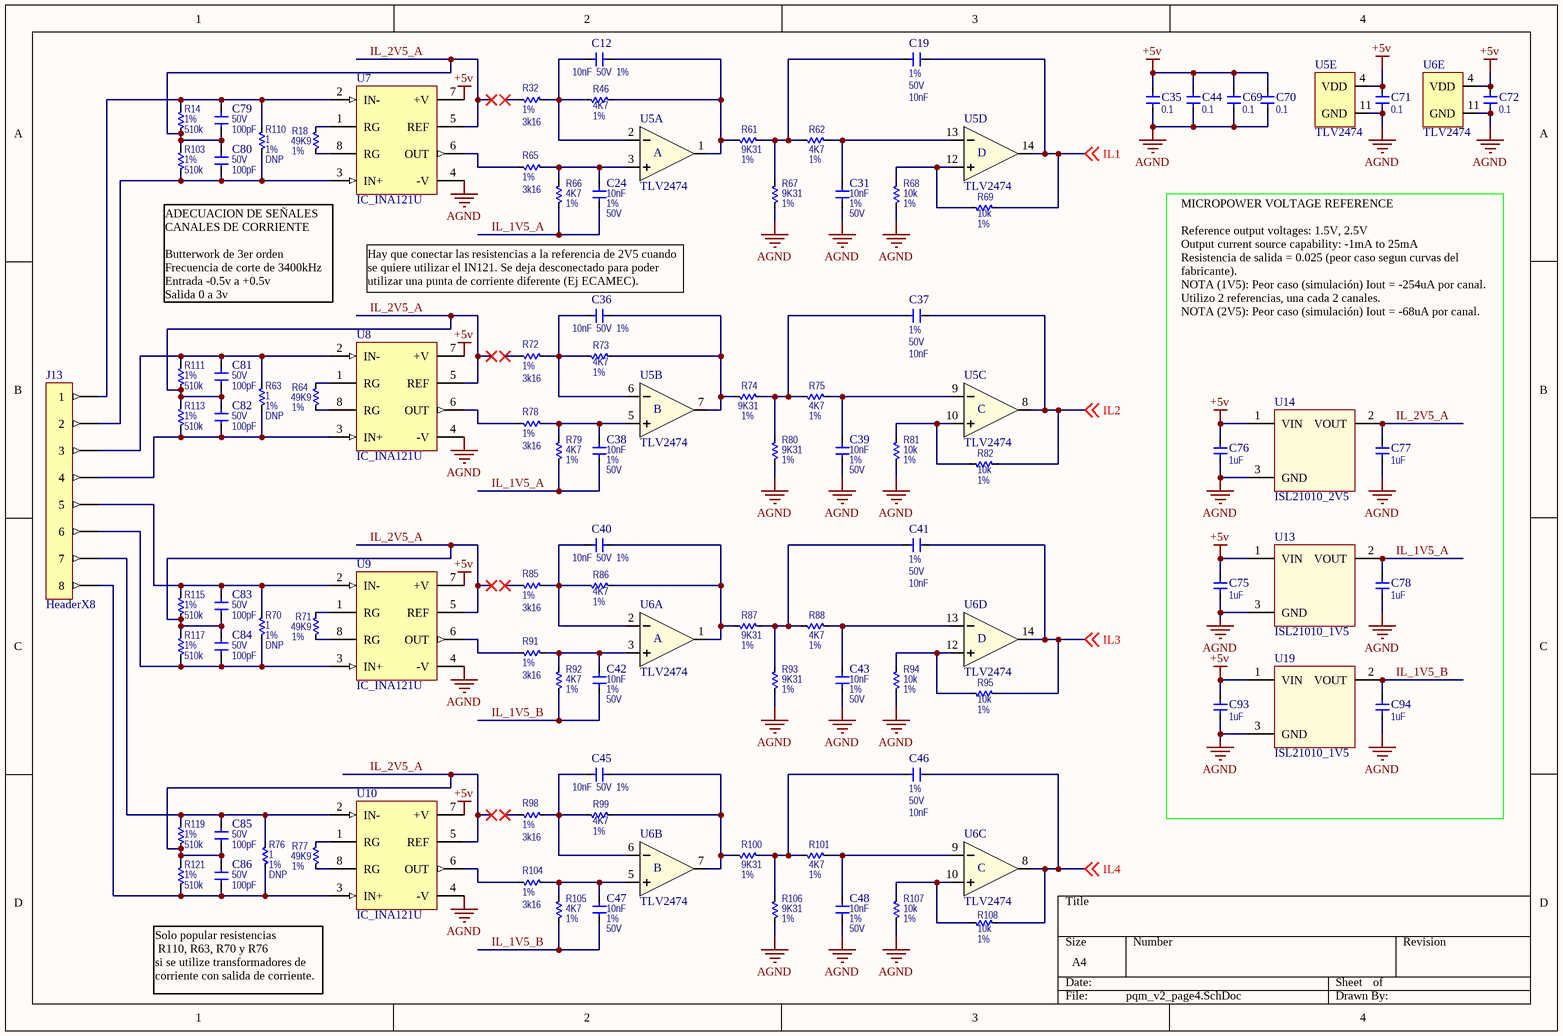
[diagram p3: pqm_v2_page4.SchDoc]

### Parts
C12  value 10nF  Tolerance: 1%  Voltage Rating: 50V  [CAPC2013X110N]  (hidden comment: CAP_GRM2195C1H103FA01D_MURATA)
C19  value 10nF  Tolerance: 1%  Voltage Rating: 50V  [CAPC2013X110N]  (hidden comment: CAP_GRM2195C1H103FA01D_MURATA)
C24  value 10nF  Tolerance: 1%  Voltage Rating: 50V  [CAPC2013X110N]  (hidden comment: CAP_GRM2195C1H103FA01D_MURATA)
C31  value 10nF  Tolerance: 1%  Voltage Rating: 50V  [CAPC2013X110N]  (hidden comment: CAP_GRM2195C1H103FA01D_MURATA)
C35  value 0.1  [CAPC2013X110N]  (hidden comment: CAP_CC0805KRX7R8BB104_YAGEO)
C36  value 10nF  Tolerance: 1%  Voltage Rating: 50V  [CAPC2013X110N]  (hidden comment: CAP_GRM2195C1H103FA01D_MURATA)
C37  value 10nF  Tolerance: 1%  Voltage Rating: 50V  [CAPC2013X110N]  (hidden comment: CAP_GRM2195C1H103FA01D_MURATA)
C38  value 10nF  Tolerance: 1%  Voltage Rating: 50V  [CAPC2013X110N]  (hidden comment: CAP_GRM2195C1H103FA01D_MURATA)
C39  value 10nF  Tolerance: 1%  Voltage Rating: 50V  [CAPC2013X110N]  (hidden comment: CAP_GRM2195C1H103FA01D_MURATA)
C40  value 10nF  Tolerance: 1%  Voltage Rating: 50V  [CAPC2013X110N]  (hidden comment: CAP_GRM2195C1H103FA01D_MURATA)
C41  value 10nF  Tolerance: 1%  Voltage Rating: 50V  [CAPC2013X110N]  (hidden comment: CAP_GRM2195C1H103FA01D_MURATA)
C42  value 10nF  Tolerance: 1%  Voltage Rating: 50V  [CAPC2013X110N]  (hidden comment: CAP_GRM2195C1H103FA01D_MURATA)
C43  value 10nF  Tolerance: 1%  Voltage Rating: 50V  [CAPC2013X110N]  (hidden comment: CAP_GRM2195C1H103FA01D_MURATA)
C44  value 0.1  [CAPC2013X110N]  (hidden comment: CAP_CC0805KRX7R8BB104_YAGEO)
C45  value 10nF  Tolerance: 1%  Voltage Rating: 50V  [CAPC2013X110N]  (hidden comment: CAP_GRM2195C1H103FA01D_MURATA)
C46  value 10nF  Tolerance: 1%  Voltage Rating: 50V  [CAPC2013X110N]  (hidden comment: CAP_GRM2195C1H103FA01D_MURATA)
C47  value 10nF  Tolerance: 1%  Voltage Rating: 50V  [CAPC2013X110N]  (hidden comment: CAP_GRM2195C1H103FA01D_MURATA)
C48  value 10nF  Tolerance: 1%  Voltage Rating: 50V  [CAPC2013X110N]  (hidden comment: CAP_GRM2195C1H103FA01D_MURATA)
C69  value 0.1  [CAPC2013X110N]  (hidden comment: CAP_CC0805KRX7R8BB104_YAGEO)
C70  value 0.1  [CAPC2013X110N]  (hidden comment: CAP_CC0805KRX7R8BB104_YAGEO)
C71  value 0.1  [CAPC2013X110N]  (hidden comment: CAP_CC0805KRX7R8BB104_YAGEO)
C72  value 0.1  [CAPC2013X110N]  (hidden comment: CAP_CC0805KRX7R8BB104_YAGEO)
C75  value 1uF  [CAPC2013X110N]  (hidden comment: CAP_CC0805KKX7R7BB105_YAGEO)
C76  value 1uF  [CAPC2013X110N]  (hidden comment: CAP_CC0805KKX7R7BB105_YAGEO)
C77  value 1uF  [CAPC2013X110N]  (hidden comment: CAP_CC0805KKX7R7BB105_YAGEO)
C78  value 1uF  [CAPC2013X110N]  (hidden comment: CAP_CC0805KKX7R7BB105_YAGEO)
C79  value 100pF  Voltage Rating: 50V  [CAPC2013X110N]  (hidden comment: CAP_CC0805JRNPO9BN101_YAGEO)
C80  value 100pF  Voltage Rating: 50V  [CAPC2013X110N]  (hidden comment: CAP_CC0805JRNPO9BN101_YAGEO)
C81  value 100pF  Voltage Rating: 50V  [CAPC2013X110N]  (hidden comment: CAP_CC0805JRNPO9BN101_YAGEO)
C82  value 100pF  Voltage Rating: 50V  [CAPC2013X110N]  (hidden comment: CAP_CC0805JRNPO9BN101_YAGEO)
C83  value 100pF  Voltage Rating: 50V  [CAPC2013X110N]  (hidden comment: CAP_CC0805JRNPO9BN101_YAGEO)
C84  value 100pF  Voltage Rating: 50V  [CAPC2013X110N]  (hidden comment: CAP_CC0805JRNPO9BN101_YAGEO)
C85  value 100pF  Voltage Rating: 50V  [CAPC2013X110N]  (hidden comment: CAP_CC0805JRNPO9BN101_YAGEO)
C86  value 100pF  Voltage Rating: 50V  [CAPC2013X110N]  (hidden comment: CAP_CC0805JRNPO9BN101_YAGEO)
C93  value 1uF  [CAPC2013X110N]  (hidden comment: CAP_CC0805KKX7R7BB105_YAGEO)
C94  value 1uF  [CAPC2013X110N]  (hidden comment: CAP_CC0805KKX7R7BB105_YAGEO)
J13  HeaderX8  [BorneraX8]
R14  value 510k  Tolerance: 1%  [RESC2013X065BN]  (hidden comment: RES_RC0805FR-07510KL_YAGEO)
R18  value 49K9  Tolerance: 1%  [RESC2013X065BN]  (hidden comment: RES_RC0805FR-0749K9L_YAGEO)
R32  value 3k16  Tolerance: 1%  [RESC2013X065BN]  (hidden comment: RES_RC0805FR-073K16L_YAGEO)
R46  value 4K7  Tolerance: 1%  [RESC2013X065BN]  (hidden comment: RES_RC0805FR-074K7L_YAGEO)
R61  value 9K31  Tolerance: 1%  [RESC2013X065BN]  (hidden comment: RES_RC0805FR-079K31L_YAGEO)
R62  value 4K7  Tolerance: 1%  [RESC2013X065BN]  (hidden comment: RES_RC0805FR-074K7L_YAGEO)
R63  value 1  Tolerance: 1%  [RESC2013X065BN]  (hidden comment: RES_RC0805FR-071RL_YAGEO)
R64  value 49K9  Tolerance: 1%  [RESC2013X065BN]  (hidden comment: RES_RC0805FR-0749K9L_YAGEO)
R65  value 3k16  Tolerance: 1%  [RESC2013X065BN]  (hidden comment: RES_RC0805FR-073K16L_YAGEO)
R66  value 4K7  Tolerance: 1%  [RESC2013X065BN]  (hidden comment: RES_RC0805FR-074K7L_YAGEO)
R67  value 9K31  Tolerance: 1%  [RESC2013X065BN]  (hidden comment: RES_RC0805FR-079K31L_YAGEO)
R68  value 10k  Tolerance: 1%  [RESC2013X065BN]  (hidden comment: RES_RC0805FR-0710KL_YAGEO)
R69  value 10k  Tolerance: 1%  [RESC2013X065BN]  (hidden comment: RES_RC0805FR-0710KL_YAGEO)
R70  value 1  Tolerance: 1%  [RESC2013X065BN]  (hidden comment: RES_RC0805FR-071RL_YAGEO)
R71  value 49K9  Tolerance: 1%  [RESC2013X065BN]  (hidden comment: RES_RC0805FR-0749K9L_YAGEO)
R72  value 3k16  Tolerance: 1%  [RESC2013X065BN]  (hidden comment: RES_RC0805FR-073K16L_YAGEO)
R73  value 4K7  Tolerance: 1%  [RESC2013X065BN]  (hidden comment: RES_RC0805FR-074K7L_YAGEO)
R74  value 9K31  Tolerance: 1%  [RESC2013X065BN]  (hidden comment: RES_RC0805FR-079K31L_YAGEO)
R75  value 4K7  Tolerance: 1%  [RESC2013X065BN]  (hidden comment: RES_RC0805FR-074K7L_YAGEO)
R76  value 1  Tolerance: 1%  [RESC2013X065BN]  (hidden comment: RES_RC0805FR-071RL_YAGEO)
R77  value 49K9  Tolerance: 1%  [RESC2013X065BN]  (hidden comment: RES_RC0805FR-0749K9L_YAGEO)
R78  value 3k16  Tolerance: 1%  [RESC2013X065BN]  (hidden comment: RES_RC0805FR-073K16L_YAGEO)
R79  value 4K7  Tolerance: 1%  [RESC2013X065BN]  (hidden comment: RES_RC0805FR-074K7L_YAGEO)
R80  value 9K31  Tolerance: 1%  [RESC2013X065BN]  (hidden comment: RES_RC0805FR-079K31L_YAGEO)
R81  value 10k  Tolerance: 1%  [RESC2013X065BN]  (hidden comment: RES_RC0805FR-0710KL_YAGEO)
R82  value 10k  Tolerance: 1%  [RESC2013X065BN]  (hidden comment: RES_RC0805FR-0710KL_YAGEO)
R85  value 3k16  Tolerance: 1%  [RESC2013X065BN]  (hidden comment: RES_RC0805FR-073K16L_YAGEO)
R86  value 4K7  Tolerance: 1%  [RESC2013X065BN]  (hidden comment: RES_RC0805FR-074K7L_YAGEO)
R87  value 9K31  Tolerance: 1%  [RESC2013X065BN]  (hidden comment: RES_RC0805FR-079K31L_YAGEO)
R88  value 4K7  Tolerance: 1%  [RESC2013X065BN]  (hidden comment: RES_RC0805FR-074K7L_YAGEO)
R91  value 3k16  Tolerance: 1%  [RESC2013X065BN]  (hidden comment: RES_RC0805FR-073K16L_YAGEO)
R92  value 4K7  Tolerance: 1%  [RESC2013X065BN]  (hidden comment: RES_RC0805FR-074K7L_YAGEO)
R93  value 9K31  Tolerance: 1%  [RESC2013X065BN]  (hidden comment: RES_RC0805FR-079K31L_YAGEO)
R94  value 10k  Tolerance: 1%  [RESC2013X065BN]  (hidden comment: RES_RC0805FR-0710KL_YAGEO)
R95  value 10k  Tolerance: 1%  [RESC2013X065BN]  (hidden comment: RES_RC0805FR-0710KL_YAGEO)
R98  value 3k16  Tolerance: 1%  [RESC2013X065BN]  (hidden comment: RES_RC0805FR-073K16L_YAGEO)
R99  value 4K7  Tolerance: 1%  [RESC2013X065BN]  (hidden comment: RES_RC0805FR-074K7L_YAGEO)
R100  value 9K31  Tolerance: 1%  [RESC2013X065BN]  (hidden comment: RES_RC0805FR-079K31L_YAGEO)
R101  value 4K7  Tolerance: 1%  [RESC2013X065BN]  (hidden comment: RES_RC0805FR-074K7L_YAGEO)
R103  value 510k  Tolerance: 1%  [RESC2013X065BN]  (hidden comment: RES_RC0805FR-07510KL_YAGEO)
R104  value 3k16  Tolerance: 1%  [RESC2013X065BN]  (hidden comment: RES_RC0805FR-073K16L_YAGEO)
R105  value 4K7  Tolerance: 1%  [RESC2013X065BN]  (hidden comment: RES_RC0805FR-074K7L_YAGEO)
R106  value 9K31  Tolerance: 1%  [RESC2013X065BN]  (hidden comment: RES_RC0805FR-079K31L_YAGEO)
R107  value 10k  Tolerance: 1%  [RESC2013X065BN]  (hidden comment: RES_RC0805FR-0710KL_YAGEO)
R108  value 10k  Tolerance: 1%  [RESC2013X065BN]  (hidden comment: RES_RC0805FR-0710KL_YAGEO)
R110  value 1  Tolerance: 1%  [RESC2013X065BN]  (hidden comment: RES_RC0805FR-071RL_YAGEO)
R111  value 510k  Tolerance: 1%  [RESC2013X065BN]  (hidden comment: RES_RC0805FR-07510KL_YAGEO)
R113  value 510k  Tolerance: 1%  [RESC2013X065BN]  (hidden comment: RES_RC0805FR-07510KL_YAGEO)
R115  value 510k  Tolerance: 1%  [RESC2013X065BN]  (hidden comment: RES_RC0805FR-07510KL_YAGEO)
R117  value 510k  Tolerance: 1%  [RESC2013X065BN]  (hidden comment: RES_RC0805FR-07510KL_YAGEO)
R119  value 510k  Tolerance: 1%  [RESC2013X065BN]  (hidden comment: RES_RC0805FR-07510KL_YAGEO)
R121  value 510k  Tolerance: 1%  [RESC2013X065BN]  (hidden comment: RES_RC0805FR-07510KL_YAGEO)
U5  value TLV2474  [SOIC127P600-14AN]  (hidden comment: IC_TLV2474_ANALOG)  (parts A,B,C,D,E of 5)
U6  value TLV2474  [SOIC127P600-14AN]  (hidden comment: IC_TLV2474_ANALOG)  (parts A,B,C,D,E of 5)
U7  IC_INA121U  [SOIC127P600-8BN]
U8  IC_INA121U  [SOIC127P600-8BN]
U9  IC_INA121U  [SOIC127P600-8BN]
U10  IC_INA121U  [SOIC127P600-8BN]
U13  ISL21010_1V5  [SOT23-3M]
U14  ISL21010_2V5  [SOT23-3M]
U19  ISL21010_1V5  [SOT23-3M]

### Nets
+5v: C35.1(T1) C44.1(T1) C69.1(T1) C70.1(T1) C71.1(T1) C72.1(T1) C75.1(T1) C76.1(T1) C93.1(T1) U5.4(VDD) U6.4(VDD) U7.7(+V) U8.7(+V) U9.7(+V) U10.7(+V) U13.1(VIN) U14.1(VIN) U19.1(VIN)
AGND: C31.1(T1) C35.2(T2) C39.1(T1) C43.1(T1) C44.2(T2) C48.1(T1) C69.2(T2) C70.2(T2) C71.2(T2) C72.2(T2) C75.2(T2) C76.2(T2) C77.2(T2) C78.2(T2) C93.2(T2) C94.2(T2) R67.1(T1) R68.2(T2) R80.1(T1) R81.2(T2) R93.1(T1) R94.2(T2) R106.1(T1) R107.2(T2) U5.11(GND) U6.11(GND) U7.4(-V) U8.4(-V) U9.4(-V) U10.4(-V) U13.3(GND) U14.3(GND) U19.3(GND)
IL1: C19.2(T2) R69.1(T1) U5.14(OUTD) ; off-sheet IL1
IL2: C37.2(T2) R82.1(T1) U5.8(OUTC) ; off-sheet IL2
IL3: C41.2(T2) R95.1(T1) U6.14(OUTD) ; off-sheet IL3
IL4: C46.2(T2) R108.1(T1) U6.8(OUTC) ; off-sheet IL4
IL_1V5_A: C24.1(T1) C38.1(T1) C78.1(T1) R66.2(T2) R79.2(T2) U13.2(VOUT)
IL_1V5_B: C42.1(T1) C47.1(T1) C94.1(T1) R92.2(T2) R105.2(T2) U19.2(VOUT)
IL_2V5_A: C77.1(T1) C79.2(T2) C80.1(T1) C81.2(T2) C82.1(T1) C83.2(T2) C84.1(T1) C85.2(T2) C86.1(T1) R14.1(T1) R103.2(T2) R111.1(T1) R113.2(T2) R115.1(T1) R117.2(T2) R119.1(T1) R121.2(T2) U7.5(REF) U8.5(REF) U9.5(REF) U10.5(REF) U14.2(VOUT)
NetC12_1: C12.1(T1) R32.1(T1) R46.2(T2) U5.2(INA-)
NetC12_2: C12.2(T2) R46.1(T1) R61.2(T2) U5.1(OUTA)
NetC19_1: C19.1(T1) R61.1(T1) R62.2(T2) R67.2(T2)
NetC24_2: C24.2(T2) R65.1(T1) R66.1(T1) U5.3(INA+)
NetC31_2: C31.2(T2) R62.1(T1) U5.13(IND-)
NetC36_1: C36.1(T1) R72.1(T1) R73.2(T2) U5.6(INB-)
NetC36_2: C36.2(T2) R73.1(T1) R74.2(T2) U5.7(OUTB)
NetC37_1: C37.1(T1) R74.1(T1) R75.2(T2) R80.2(T2)
NetC38_2: C38.2(T2) R78.1(T1) R79.1(T1) U5.5(INB+)
NetC39_2: C39.2(T2) R75.1(T1) U5.9(INC-)
NetC40_1: C40.1(T1) R85.1(T1) R86.2(T2) U6.2(INA-)
NetC40_2: C40.2(T2) R86.1(T1) R87.2(T2) U6.1(OUTA)
NetC41_1: C41.1(T1) R87.1(T1) R88.2(T2) R93.2(T2)
NetC42_2: C42.2(T2) R91.1(T1) R92.1(T1) U6.3(INA+)
NetC43_2: C43.2(T2) R88.1(T1) U6.13(IND-)
NetC45_1: C45.1(T1) R98.1(T1) R99.2(T2) U6.6(INB-)
NetC45_2: C45.2(T2) R99.1(T1) R100.2(T2) U6.7(OUTB)
NetC46_1: C46.1(T1) R100.1(T1) R101.2(T2) R106.2(T2)
NetC47_2: C47.2(T2) R104.1(T1) R105.1(T1) U6.5(INB+)
NetC48_2: C48.2(T2) R101.1(T1) U6.9(INC-)
NetC79_1: C79.1(T1) J13.1 R14.2(T2) R110.2(T2) U7.2(IN-)
NetC80_2: C80.2(T2) J13.2 R103.1(T1) R110.1(T1) U7.3(IN+)
NetC81_1: C81.1(T1) J13.3 R63.2(T2) R111.2(T2) U8.2(IN-)
NetC82_2: C82.2(T2) J13.4 R63.1(T1) R113.1(T1) U8.3(IN+)
NetC83_1: C83.1(T1) J13.5 R70.2(T2) R115.2(T2) U9.2(IN-)
NetC84_2: C84.2(T2) J13.6 R70.1(T1) R117.1(T1) U9.3(IN+)
NetC85_1: C85.1(T1) J13.7 R76.2(T2) R119.2(T2) U10.2(IN-)
NetC86_2: C86.2(T2) J13.8 R76.1(T1) R121.1(T1) U10.3(IN+)
NetR18_1: R18.1(T1) U7.8(RG)
NetR18_2: R18.2(T2) U7.1(RG)
NetR64_1: R64.1(T1) U8.8(RG)
NetR64_2: R64.2(T2) U8.1(RG)
NetR65_2: R65.2(T2) U7.6(OUT)
NetR68_1: R68.1(T1) R69.2(T2) U5.12(IND+)
NetR71_1: R71.1(T1) U9.8(RG)
NetR71_2: R71.2(T2) U9.1(RG)
NetR77_1: R77.1(T1) U10.8(RG)
NetR77_2: R77.2(T2) U10.1(RG)
NetR78_2: R78.2(T2) U8.6(OUT)
NetR81_1: R81.1(T1) R82.2(T2) U5.10(INC+)
NetR91_2: R91.2(T2) U9.6(OUT)
NetR94_1: R94.1(T1) R95.2(T2) U6.12(IND+)
NetR104_2: R104.2(T2) U10.6(OUT)
NetR107_1: R107.1(T1) R108.2(T2) U6.10(INC+)

Not connected (* = marked no-connect by the designer): R32 2(T2)*; R72 2(T2)*; R85 2(T2)*; R98 2(T2)*

### Notes on the sheet
- (near R110) DNP
- ADECUACION DE SEÑALES
  CANALES DE CORRIENTE
  Butterwork de 3er orden
  Frecuencia de corte de 3400kHz
  Entrada -0.5v a +0.5v
  Salida 0 a 3v
- (near C36) Hay que conectar las resistencias a la referencia de 2V5 cuando se quiere utilizar el IN121. Se deja desconectado para poder utilizar una punta de corriente diferente (Ej ECAMEC).
- MICROPOWER VOLTAGE REFERENCE
  Reference output voltages: 1.5V, 2.5V
  Output current source capability: -1mA to 25mA
  Resistencia de salida = 0.025 (peor caso segun curvas del fabricante).
  NOTA (1V5): Peor caso (simulación) Iout = -254uA por canal. Utilizo 2 referencias, una cada 2 canales.
  NOTA (2V5): Peor caso (simulación) Iout = -68uA por canal.
- (near R63) DNP
- (near R70) DNP
- (near R76) DNP
- Solo popular resistencias
  R110, R63, R70 y R76
  si se utilize transformadores de corriente con salida de corriente.
- (in symbol IC_TLV2474_ANALOG, part A) A
- (in symbol IC_TLV2474_ANALOG, part B) B
- (in symbol IC_TLV2474_ANALOG, part C) C
- (in symbol IC_TLV2474_ANALOG, part D) D

### Library data of the parts
C12 C19 C24 C31 C36-C43 C45-C48 = CAP_GRM2195C1H103FA01D_MURATA: as C8 on sheet pqm_v2_page3; Supplier: *; Power Rating: *; BOM Populate: *; Digikey Part Number: 490-8295-1-ND; Mouser Part Number: 81-GRM2195C1H103FA1D; Manufacturer Part Number: GRM2195C1H103FA01D
C35 C44 C69-C72 = CAP_CC0805KRX7R8BB104_YAGEO: as C14 on sheet pqm_v2_page1; Supplier: *; Tolerance: 10%; Power Rating: *; Voltage Rating: 25V; BOM Populate: *; Digikey Part Number: 311-1141-1-ND; Mouser Part Number: 603-CC805KRX7R8BB104; Manufacturer Part Number: CC0805KRX7R8BB104
C75-C78 C93 C94 = CAP_CC0805KKX7R7BB105_YAGEO: as C34 on sheet pqm_v2_page1; Supplier: *; Supplier Part No: *; Power Rating: *; BOM Populate: *; Voltage Rating: 16V; Digikey Part Number: 311-1365-1-ND; Mouser Part Number: 603-CC805KKX7R7BB105; Manufacturer Part Number: CC0805KKX7R7BB105
C79-C86 = CAP_CC0805JRNPO9BN101_YAGEO: CAP CER 100PF 50V NPO 0805; Manufacturer: Yageo; Tolerance: 5%; Supplier: *; Power Rating: *; BOM Populate: *; Digikey Part Number: 311-1111-1-ND; Mouser Part Number: 603-CC805JRNPO9BN101; Manufacturer Part Number: CC0805JRNPO9BN101
J13 = CON_HeaderX8
R14 R103 R111 R113 R115 R117 R119 R121 = RES_RC0805FR-07510KL_YAGEO: RES SMD 510K OHM 1% 1/8W 0805; Manufacturer: Yageo; BOM Populate: *; Supplier Part No: *; Supplier: *; Digikey Part Number: 311-510KCRCT-ND; Power Rating: 1/8W; Manufacturer Part Number: RC0805FR-07510KL; Mouser Part Number: 603-RC0805FR-07510KL
R18 R64 R71 R77 = RES_RC0805FR-0749K9L_YAGEO: RES SMD 49.9K OHM 1% 1/8W 0805; Manufacturer: Yageo; BOM Populate: *; Supplier Part No: *; Supplier: *; Digikey Part Number: 311-49.9KCRCT-ND; Power Rating: 1/8W; Manufacturer Part Number: RC0805FR-0749K9L; Mouser Part Number: 603-RC0805FR-0749K9L
R32 R65 R72 R78 R85 R91 R98 R104 = RES_RC0805FR-073K16L_YAGEO: RES SMD 3.16K OHM 1% 1/8W 0805; Manufacturer: Yageo; BOM Populate: *; Supplier Part No: *; Supplier: *; Digikey Part Number: 311-3.16KCRCT-ND; Power Rating: 1/8W; Manufacturer Part Number: RC0805FR-073K16L; Mouser Part Number: 603-RC0805FR-073K16L
R46 R62 R66 R73 R75 R79 R86 R88 R92 R99 R101 R105 = RES_RC0805FR-074K7L_YAGEO: as R8 on sheet pqm_v2_page3; BOM Populate: *; Supplier Part No: *; Supplier: *; Digikey Part Number: 311-4.70KCRCT-ND; Power Rating: 1/8W; Manufacturer Part Number: RC0805FR-074K7L; Mouser Part Number: 603-RC0805FR-074K7L
R61 R67 R74 R80 R87 R93 R100 R106 = RES_RC0805FR-079K31L_YAGEO: as R9 on sheet pqm_v2_page3; BOM Populate: *; Supplier Part No: *; Supplier: *; Digikey Part Number: 311-9.31KCRCT-ND; Power Rating: 1/8W; Manufacturer Part Number: RC0805FR-079K31L; Mouser Part Number: 603-RC0805FR-079K31L
R63 R70 R76 R110 = RES_RC0805FR-071RL_YAGEO: RES SMD 1 OHM 1% 1/8W 0805; Manufacturer: Yageo; BOM Populate: *; Supplier Part No: *; Supplier: *; Digikey Part Number: 311-1.00CRCT-ND; Power Rating: 1/8W; Manufacturer Part Number: RC0805FR-071RL; Mouser Part Number: 603-RC0805FR-071RL
R68 R69 R81 R82 R94 R95 R107 R108 = RES_RC0805FR-0710KL_YAGEO: as R4 on sheet pqm_v2_page3; BOM Populate: *; Supplier Part No: *; Supplier: *; Digikey Part Number: 311-10.0KCRCT-ND; Power Rating: 1/8W; Manufacturer Part Number: RC0805FR-0710KL; Mouser Part Number: 603-RC0805FR-0710KL
U5 U6 = IC_TLV2474_ANALOG: IC OPAMP GP 2.8MHZ RRO 14SOIC; Manufacturer: Texas Instrument; Manufacturer Part Number: TLV2474CDR; BOM_Populate: *; Digikey Part Number: 296-2442-1-ND; Mouser Part Number: 595-TLV2474CDR
U7-U10 = IC_INA121U: IC OPAMP INSTR 600KHZ 8SOIC; Manufacturer Part Number: INA121UA; Digikey Part Number: INA121UA-ND; Mouser Part Number: 595-INA121UA
U13 U19 = IC_ISL21010_1V5_INTERSIL: as U12 on sheet pqm_v2_page3; Digikey Part Number: ISL21010CFH315Z-TKCT-ND; Mouser Part Number: 968-ISL21010CFH315ZT
U14 = IC_ISL21010_2V5_INTERSIL: IC VREF SERIES 2.5V SOT23-3; Manufacturer Part Number: ISL21010CFH325Z-TK; Digikey Part Number: ISL21010CFH325Z-TKCT-ND; Mouser Part Number: 968-ISL21010CFH325ZT